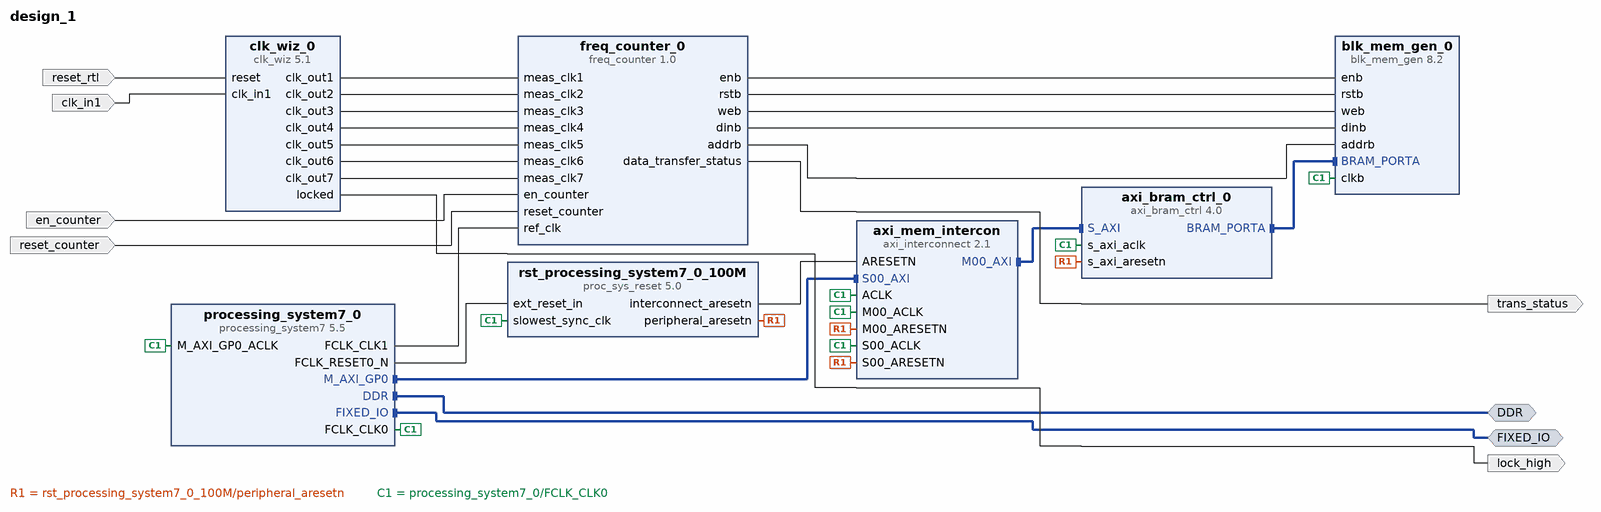
[diagram p0: block diagram of the top level]
# Vivado block design design_1, Vivado 2014.3.1
create_bd_design design_1

create_bd_intf_port -mode Master -vlnv xilinx.com:interface:ddrx_rtl:1.0 DDR
create_bd_intf_port -mode Master -vlnv xilinx.com:display_processing_system7:fixedio_rtl:1.0 FIXED_IO
create_bd_port -dir I -type rst reset_rtl
set_property -dict {CONFIG.POLARITY ACTIVE_HIGH} [get_bd_ports reset_rtl]
create_bd_port -dir I -type clk clk_in1
set_property -dict {CONFIG.FREQ_HZ 125000000 CONFIG.CLK_DOMAIN design_1_processing_system7_0_0_FCLK_CLK0} [get_bd_ports clk_in1]
create_bd_port -dir O lock_high
create_bd_port -dir I en_counter
create_bd_port -dir I reset_counter
create_bd_port -dir O trans_status

create_bd_cell -type ip -vlnv xilinx.com:ip:axi_bram_ctrl:4.0 axi_bram_ctrl_0
set_property -dict [list \
  CONFIG.DATA_WIDTH 32 \
  CONFIG.PROTOCOL AXI4 \
  CONFIG.SUPPORTS_NARROW_BURST 0 \
  CONFIG.SINGLE_PORT_BRAM 1 \
  CONFIG.USE_ECC 0 \
] [get_bd_cells axi_bram_ctrl_0]
create_bd_cell -type ip -vlnv xilinx.com:ip:blk_mem_gen:8.2 blk_mem_gen_0
set_property -dict [list \
  CONFIG.Memory_Type True_Dual_Port_RAM \
  CONFIG.Enable_32bit_Address true \
  CONFIG.Write_Depth_A 8192 \
  CONFIG.Enable_B Use_ENB_Pin \
  CONFIG.Register_PortA_Output_of_Memory_Primitives false \
  CONFIG.Use_RSTA_Pin true \
  CONFIG.Use_RSTB_Pin true \
  CONFIG.Port_B_Clock 100 \
  CONFIG.Port_B_Write_Rate 50 \
  CONFIG.Port_B_Enable_Rate 100 \
  CONFIG.use_bram_block BRAM_Controller \
] [get_bd_cells blk_mem_gen_0]
create_bd_cell -type ip -vlnv xilinx.com:ip:processing_system7:5.5 processing_system7_0
set_property -dict [list \
  CONFIG.PCW_UIPARAM_DDR_FREQ_MHZ 525 \
  CONFIG.PCW_CRYSTAL_PERIPHERAL_FREQMHZ 50.000000 \
  CONFIG.PCW_APU_PERIPHERAL_FREQMHZ 650 \
  CONFIG.PCW_SDIO_PERIPHERAL_FREQMHZ 50 \
  CONFIG.PCW_FPGA0_PERIPHERAL_FREQMHZ 200 \
  CONFIG.PCW_FPGA1_PERIPHERAL_FREQMHZ 100 \
  CONFIG.PCW_FPGA2_PERIPHERAL_FREQMHZ 25 \
  CONFIG.PCW_EN_CLK1_PORT 1 \
  CONFIG.PCW_PRESET_BANK1_VOLTAGE {LVCMOS 1.8V} \
  CONFIG.PCW_UIPARAM_DDR_PARTNO {MT41K128M16 JT-125} \
  CONFIG.PCW_QSPI_PERIPHERAL_ENABLE 1 \
  CONFIG.PCW_QSPI_GRP_SINGLE_SS_ENABLE 1 \
  CONFIG.PCW_QSPI_GRP_FBCLK_ENABLE 1 \
  CONFIG.PCW_ENET0_PERIPHERAL_ENABLE 1 \
  CONFIG.PCW_ENET0_ENET0_IO {MIO 16 .. 27} \
  CONFIG.PCW_ENET0_GRP_MDIO_ENABLE 1 \
  CONFIG.PCW_ENET0_RESET_ENABLE 0 \
  CONFIG.PCW_SD0_PERIPHERAL_ENABLE 1 \
  CONFIG.PCW_SD0_GRP_CD_ENABLE 1 \
  CONFIG.PCW_SD0_GRP_CD_IO {MIO 47} \
  CONFIG.PCW_SD0_GRP_WP_ENABLE 1 \
  CONFIG.PCW_UART1_PERIPHERAL_ENABLE 1 \
  CONFIG.PCW_SPI1_PERIPHERAL_ENABLE 1 \
  CONFIG.PCW_SPI1_SPI1_IO {MIO 10 .. 15} \
  CONFIG.PCW_SPI1_GRP_SS1_ENABLE 1 \
  CONFIG.PCW_TTC0_PERIPHERAL_ENABLE 1 \
  CONFIG.PCW_USB0_PERIPHERAL_ENABLE 1 \
  CONFIG.PCW_USB0_RESET_ENABLE 1 \
  CONFIG.PCW_USB0_RESET_IO {MIO 46} \
  CONFIG.PCW_GPIO_MIO_GPIO_ENABLE 1 \
  CONFIG.preset {Default*} \
] [get_bd_cells processing_system7_0]
# 113 more settings of processing_system7_0 are not shown: defaults, MIO pin electricals, DDR timing, and values the tool derives
create_bd_cell -type ip -vlnv xilinx.com:ip:axi_interconnect:2.1 axi_mem_intercon
set_property -dict {CONFIG.NUM_MI 1} [get_bd_cells axi_mem_intercon]
create_bd_cell -type ip -vlnv xilinx.com:ip:proc_sys_reset:5.0 rst_processing_system7_0_100M
create_bd_cell -type ip -vlnv xilinx.com:ip:clk_wiz:5.1 clk_wiz_0
set_property -dict [list \
  CONFIG.PRIMITIVE MMCM \
  CONFIG.JITTER_SEL Min_O_Jitter \
  CONFIG.PRIM_IN_FREQ 125 \
  CONFIG.JITTER_OPTIONS UI \
  CONFIG.CLKIN1_UI_JITTER 0 \
  CONFIG.CLKIN1_JITTER_PS 0.0 \
  CONFIG.CLKIN2_JITTER_PS 100.0 \
  CONFIG.CLKOUT2_USED true \
  CONFIG.CLKOUT3_USED true \
  CONFIG.CLKOUT4_USED true \
  CONFIG.CLKOUT5_USED true \
  CONFIG.CLKOUT6_USED true \
  CONFIG.CLKOUT7_USED true \
  CONFIG.NUM_OUT_CLKS 7 \
  CONFIG.CLKOUT1_REQUESTED_OUT_FREQ 24.000 \
  CONFIG.CLKOUT2_REQUESTED_OUT_FREQ 25.000 \
  CONFIG.CLKOUT3_REQUESTED_OUT_FREQ 26.000 \
  CONFIG.CLKOUT4_REQUESTED_OUT_FREQ 24.5000 \
  CONFIG.CLKOUT5_REQUESTED_OUT_FREQ 27.000 \
  CONFIG.CLKOUT6_REQUESTED_OUT_FREQ 30.000 \
  CONFIG.CLKOUT7_REQUESTED_OUT_FREQ 24.000 \
  CONFIG.CLKOUT1_DRIVES BUFGCE \
  CONFIG.USE_SAFE_CLOCK_STARTUP true \
  CONFIG.CLKOUT1_JITTER 226.747 \
  CONFIG.CLKOUT1_PHASE_ERROR 224.819 \
  CONFIG.CLKOUT2_JITTER 225.304 \
  CONFIG.CLKOUT2_PHASE_ERROR 224.819 \
  CONFIG.CLKOUT3_JITTER 223.807 \
  CONFIG.CLKOUT3_PHASE_ERROR 224.819 \
  CONFIG.CLKOUT4_JITTER 226.032 \
  CONFIG.CLKOUT4_PHASE_ERROR 224.819 \
  CONFIG.CLKOUT5_JITTER 223.037 \
  CONFIG.CLKOUT5_PHASE_ERROR 224.819 \
  CONFIG.CLKOUT6_JITTER 218.939 \
  CONFIG.CLKOUT6_PHASE_ERROR 224.819 \
  CONFIG.CLKOUT7_JITTER 226.747 \
  CONFIG.CLKOUT7_PHASE_ERROR 224.819 \
] [get_bd_cells clk_wiz_0]
create_bd_cell -type ip -vlnv sitimecorp.com:ravish:freq_counter:1.0 freq_counter_0

# ---- connections ----

connect_bd_intf_net [get_bd_intf_pins processing_system7_0/M_AXI_GP0] [get_bd_intf_pins axi_mem_intercon/S00_AXI]
connect_bd_intf_net [get_bd_intf_pins axi_mem_intercon/M00_AXI] [get_bd_intf_pins axi_bram_ctrl_0/S_AXI]
connect_bd_intf_net [get_bd_intf_pins blk_mem_gen_0/BRAM_PORTA] [get_bd_intf_pins axi_bram_ctrl_0/BRAM_PORTA]
connect_bd_intf_net [get_bd_intf_ports DDR] [get_bd_intf_pins processing_system7_0/DDR]
connect_bd_intf_net [get_bd_intf_ports FIXED_IO] [get_bd_intf_pins processing_system7_0/FIXED_IO]
connect_bd_net [get_bd_pins processing_system7_0/FCLK_RESET0_N] [get_bd_pins rst_processing_system7_0_100M/ext_reset_in]
connect_bd_net [get_bd_pins rst_processing_system7_0_100M/peripheral_aresetn] \
  [get_bd_pins axi_mem_intercon/S00_ARESETN] [get_bd_pins axi_bram_ctrl_0/s_axi_aresetn] \
  [get_bd_pins axi_mem_intercon/M00_ARESETN]
connect_bd_net [get_bd_pins rst_processing_system7_0_100M/interconnect_aresetn] [get_bd_pins axi_mem_intercon/ARESETN]
connect_bd_net [get_bd_ports reset_rtl] [get_bd_pins clk_wiz_0/reset]
connect_bd_net [get_bd_pins processing_system7_0/FCLK_CLK0] \
  [get_bd_pins processing_system7_0/M_AXI_GP0_ACLK] [get_bd_pins axi_mem_intercon/S00_ACLK] \
  [get_bd_pins rst_processing_system7_0_100M/slowest_sync_clk] [get_bd_pins axi_mem_intercon/ACLK] \
  [get_bd_pins axi_bram_ctrl_0/s_axi_aclk] [get_bd_pins axi_mem_intercon/M00_ACLK] [get_bd_pins blk_mem_gen_0/clkb]
connect_bd_net -net clk_in1_1 [get_bd_ports clk_in1] [get_bd_pins clk_wiz_0/clk_in1]
connect_bd_net [get_bd_pins clk_wiz_0/locked] [get_bd_ports lock_high]
connect_bd_net [get_bd_pins freq_counter_0/enb] [get_bd_pins blk_mem_gen_0/enb]
connect_bd_net [get_bd_pins freq_counter_0/rstb] [get_bd_pins blk_mem_gen_0/rstb]
connect_bd_net [get_bd_pins freq_counter_0/web] [get_bd_pins blk_mem_gen_0/web]
connect_bd_net [get_bd_pins freq_counter_0/dinb] [get_bd_pins blk_mem_gen_0/dinb]
connect_bd_net [get_bd_pins freq_counter_0/addrb] [get_bd_pins blk_mem_gen_0/addrb]
connect_bd_net [get_bd_pins processing_system7_0/FCLK_CLK1] [get_bd_pins freq_counter_0/ref_clk]
connect_bd_net [get_bd_pins clk_wiz_0/clk_out1] [get_bd_pins freq_counter_0/meas_clk1]
connect_bd_net [get_bd_pins clk_wiz_0/clk_out2] [get_bd_pins freq_counter_0/meas_clk2]
connect_bd_net [get_bd_pins clk_wiz_0/clk_out3] [get_bd_pins freq_counter_0/meas_clk3]
connect_bd_net [get_bd_pins clk_wiz_0/clk_out4] [get_bd_pins freq_counter_0/meas_clk4]
connect_bd_net [get_bd_pins clk_wiz_0/clk_out5] [get_bd_pins freq_counter_0/meas_clk5]
connect_bd_net [get_bd_pins clk_wiz_0/clk_out6] [get_bd_pins freq_counter_0/meas_clk6]
connect_bd_net [get_bd_pins clk_wiz_0/clk_out7] [get_bd_pins freq_counter_0/meas_clk7]
connect_bd_net [get_bd_ports en_counter] [get_bd_pins freq_counter_0/en_counter]
connect_bd_net [get_bd_ports reset_counter] [get_bd_pins freq_counter_0/reset_counter]
connect_bd_net [get_bd_pins freq_counter_0/data_transfer_status] [get_bd_ports trans_status]

# ---- address map ----
assign_bd_address -offset 0x40000000 -range 4K -target_address_space [get_bd_addr_spaces processing_system7_0/Data] [get_bd_addr_segs axi_bram_ctrl_0/S_AXI/Mem0]

validate_bd_design
save_bd_design
